# Altium project P-MT3620RDB-1-6.PrjPcb (part 3 of 5)
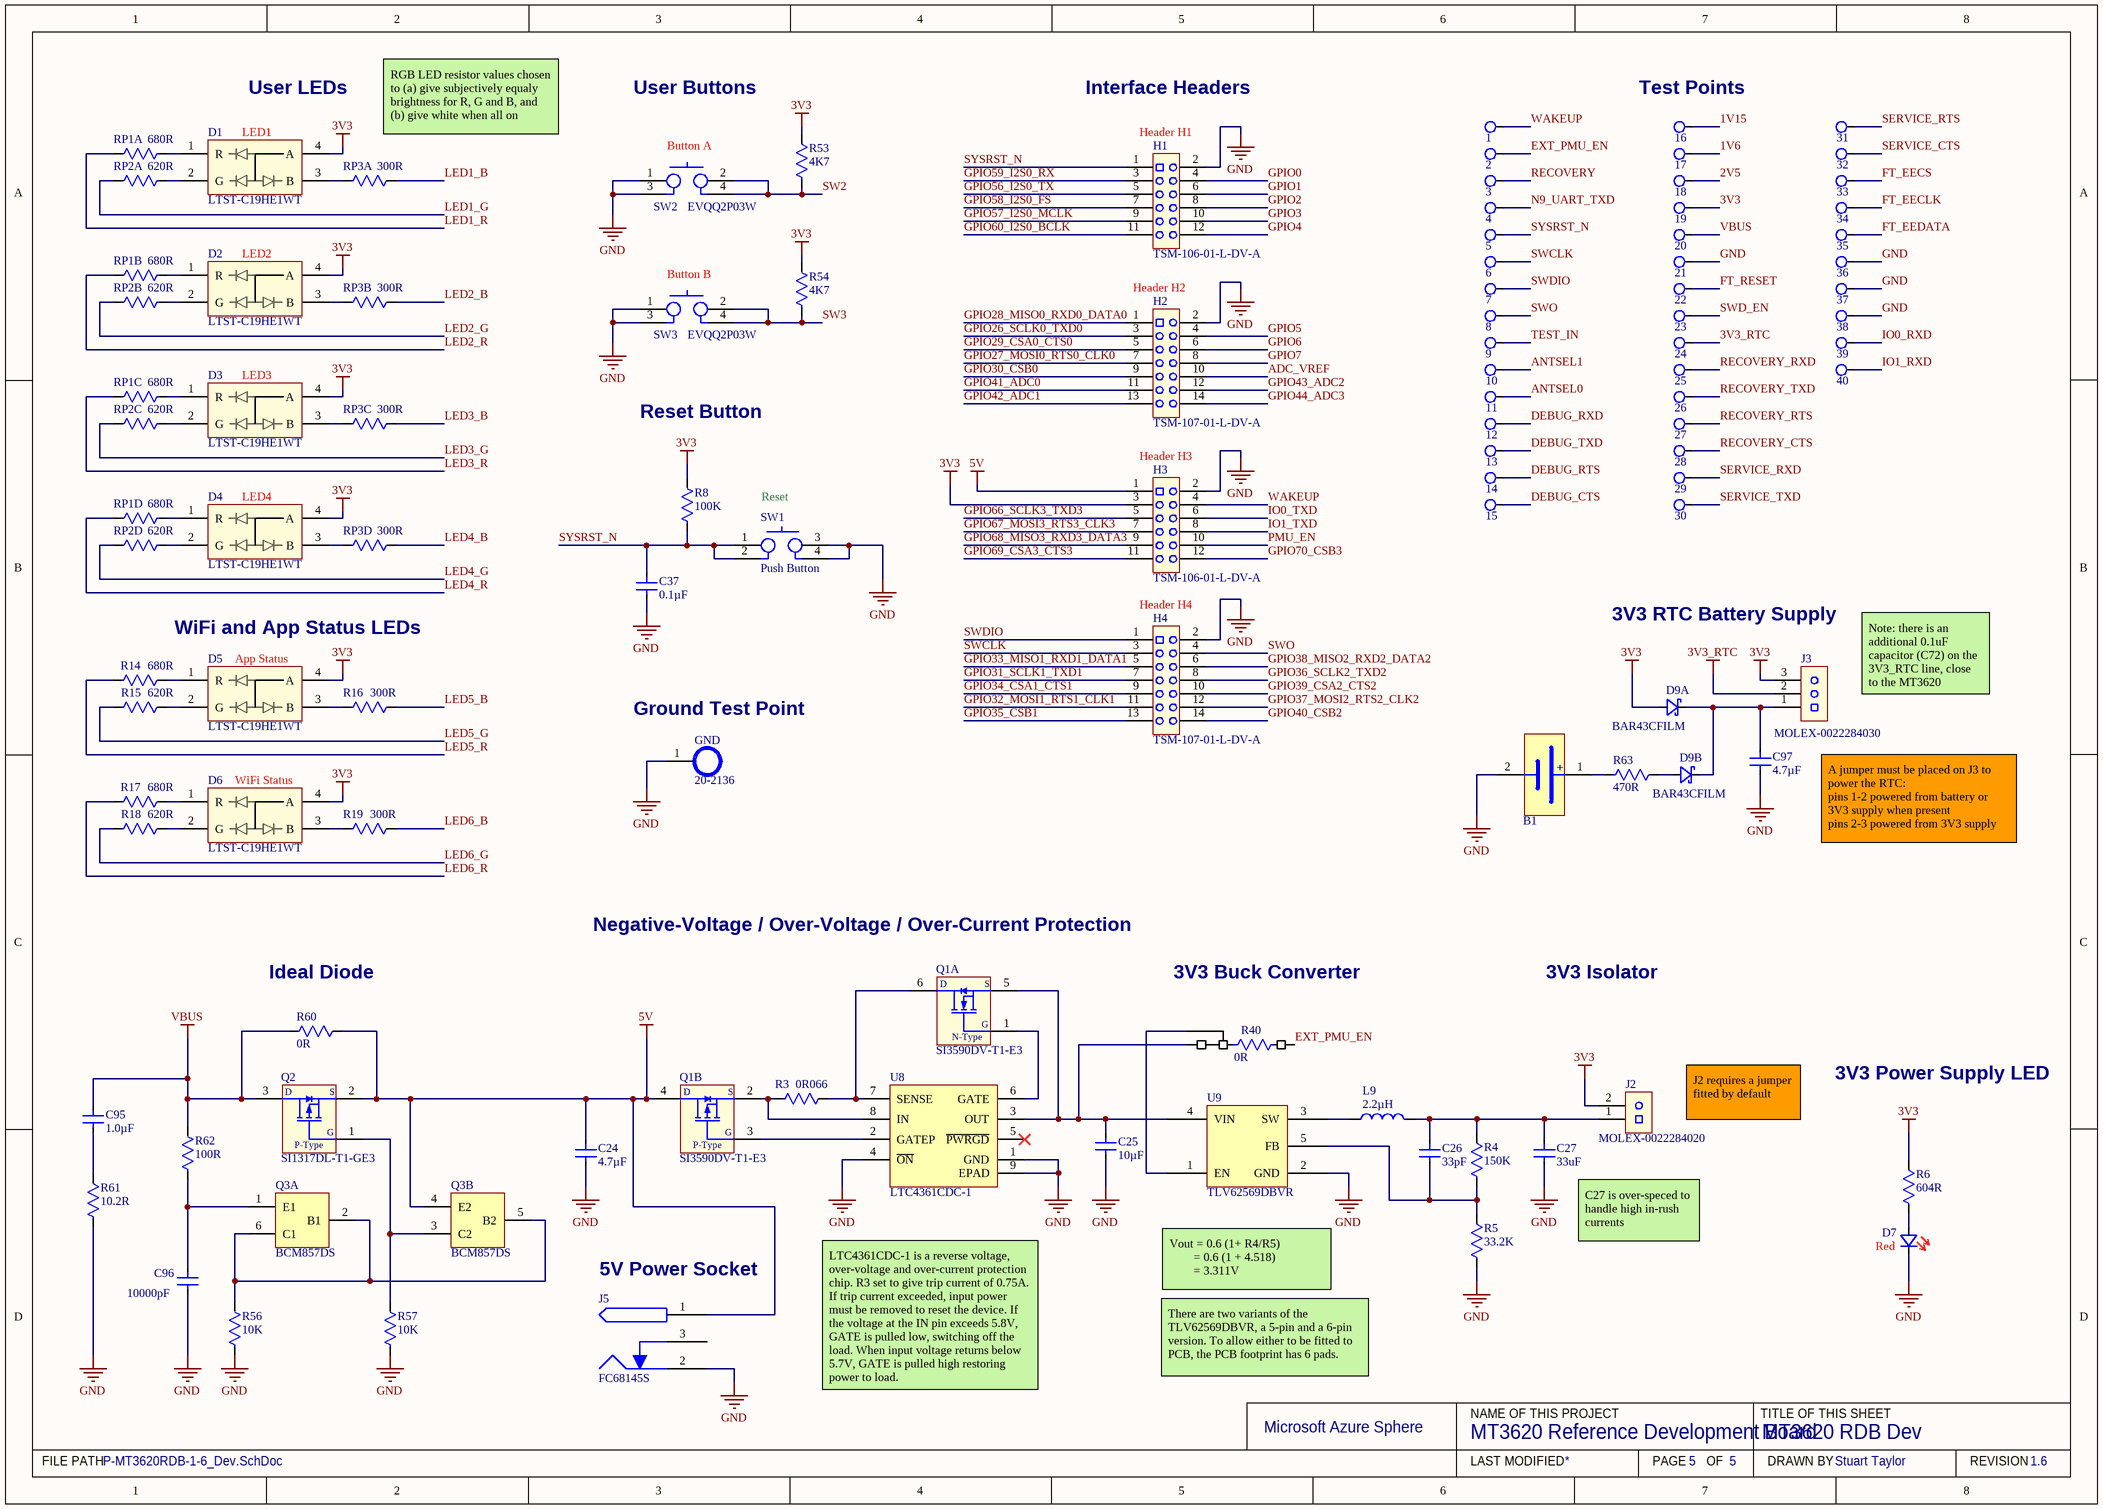
[diagram p5: P-MT3620RDB-1-6_Dev.SchDoc]

## Sheet P-MT3620RDB-1-6_Dev.SchDoc: MT3620 RDB Dev (continued)

### Notes on the sheet
- User LEDs
- User Buttons
- Interface Headers
- (near 16) Test Points
- (near D1) LED1
- (near RP3) RGB LED resistor values chosen to (a) give subjectively equaly brightness for R, G and B, and (b) give white when all on
- (near SW2) Button A
- (near H1) Header H1
- (near D2) LED2
- (near SW3) Button B
- (near H2) Header H2
- (near D3) LED3
- Reset Button
- (near D4) LED4
- (near SW1) Reset
- (near H3) Header H3
- WiFi and App Status LEDs
- Header H4
- 3V3 RTC Battery Supply
- (near D5) App Status
- (near GND) Ground Test Point
- Note: there is an additional 0.1uF capacitor (C72) on the 3V3_RTC line, close to the MT3620
- (near D6) WiFi Status
- A jumper must be placed on J3 to power the RTC:
  pins 1-2 powered from battery or 3V3 supply when present
  pins 2-3 powered from 3V3 supply
- (near R60) Ideal Diode
- Negative-Voltage / Over-Voltage / Over-Current Protection
- (near R40) 3V3 Buck Converter
- 3V3 Isolator
- J2 requires a jumper fitted by default
- 3V3 Power Supply LED
- C27 is over-speced to handle high in-rush currents
- (near J5) 5V Power Socket
- Vout = 0.6 (1+ R4/R5)
  = 0.6 (1 + 4.518)
  = 3.311V
- LTC4361CDC-1 is a reverse voltage, over-voltage and over-current protection chip. R3 set to give trip current of 0.75A. If trip current exceeded, input power must be removed to reset the device. If the voltage at the IN pin exceeds 5.8V, GATE is pulled low, switching off the load. When input voltage returns below 5.7V, GATE is pulled high restoring power to load.
- There are two variants of the TLV62569DBVR, a 5-pin and a 6-pin version. To allow either to be fitted to PCB, the PCB footprint has 6 pads.
- Microsoft Azure Sphere
- NAME OF THIS PROJECT
- TITLE OF THIS SHEET
- FILE PATH
- LAST MODIFIED
- PAGE
- OF
- DRAWN BY
- REVISION
- (in symbol SI1317DL-T1-GE3) P-Type
- (in symbol SI3590DV-T1-E3, part A) D; S; G; N-Type
- (in symbol SI3590DV-T1-E3, part B) D; S; G; P-Type